# EAGLE design usb (EAGLE 9.5.0)
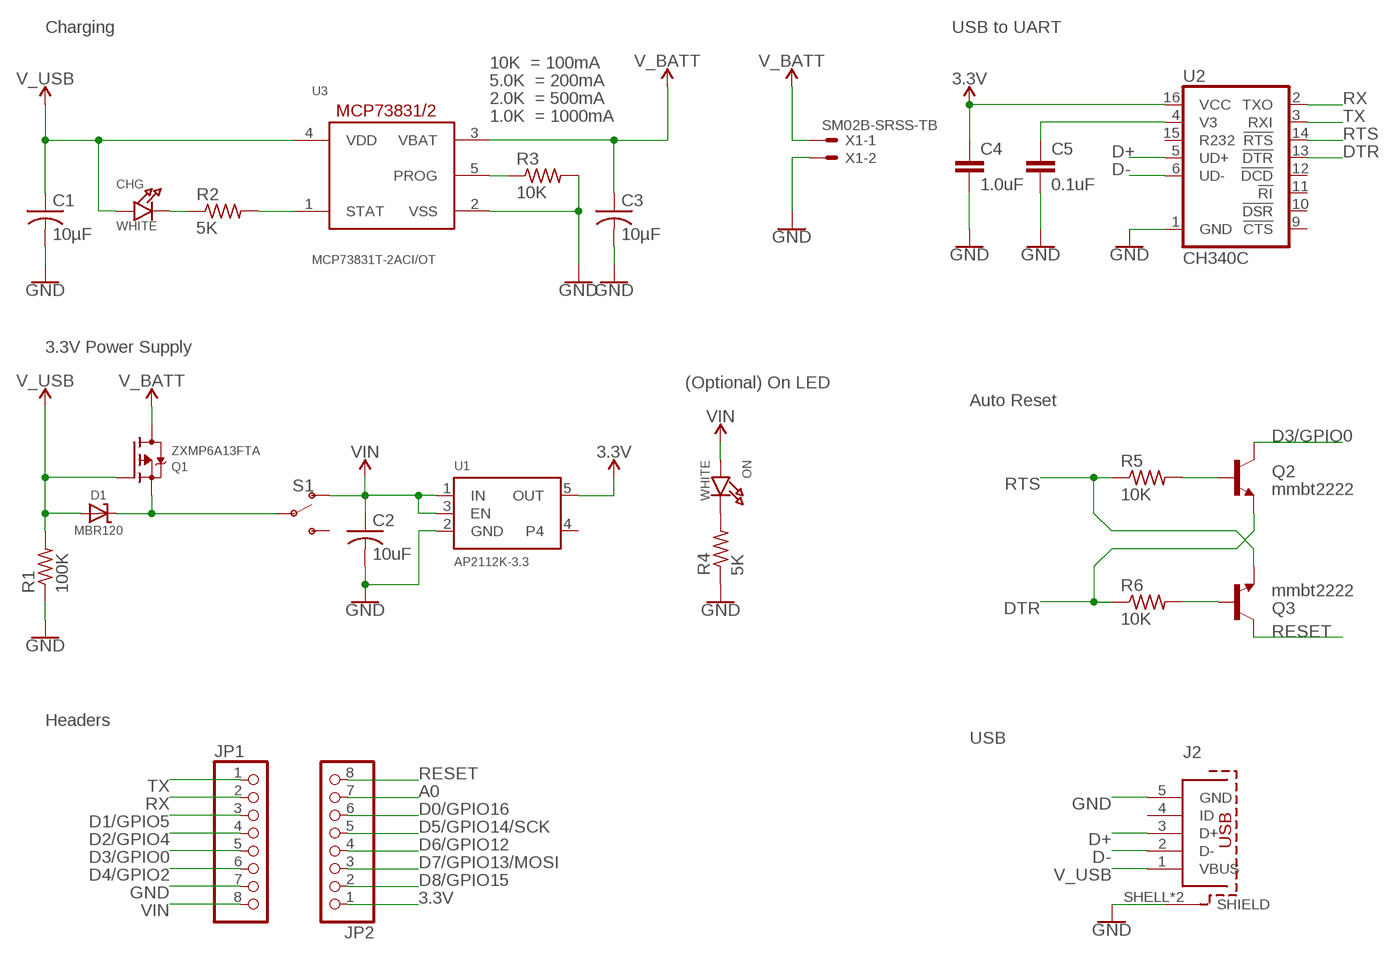
[diagram p0: schematic, sheet 1]

## Parts
C1  10µF  C-USC0805  [C0805]
C2  10uF  C-USC0805  [C0805]
C3  10µF  C-USC0805  [C0805]
C4  1.0uF  1.0UF-0805-25V-10%  [0805]
C5  0.1uF  1.0UF-0805-25V-10%  [0805]
CHG  WHITE  LED0805_NOOUTLINE  [CHIPLED_0805_NOOUTLINE]
D1  MBR120  DIODE-SCHOTTKYSOD-123  [SOD-123]
J2  614105150621  [614105150621]
JP1  PINHD-1X8CLEANBIG  [1X08-CLEANBIG]
JP2  PINHD-1X8CLEANBIG  [1X08-CLEANBIG]
ON  WHITE  LED0805_NOOUTLINE  [CHIPLED_0805_NOOUTLINE]
Q1  ZXMP6A13FTA  MOSFET-P  [SOT23-R]
Q2  mmbt2222  TRANSISTOR_NPNSOT23-3  [SOT23-3]
Q3  mmbt2222  TRANSISTOR_NPNSOT23-3  [SOT23-3]
R1  100K  R-US_R0805  [R0805]
R2  5K  R-US_R0805  [R0805]
R3  10K  R-US_R0805  [R0805]
R4  5K  R-US_R0805  [R0805]
R5  10K  R-US_R0603  [R0603]
R6  10K  R-US_R0603  [R0603]
S1  SWITCH-SPDT-SMD-AYZ0202  [SWITCH_DPDT_SMD_AYZ0202]
U1  AP2112K-3.3  VREG_SOT23-5  [SOT23-5]
U2  CH340C  [SO016]
U3  MCP73831T-2ACI/OT  MCP73831/OT  [SOT23-5L]
X1  SM02B-SRSS-TB  [SM02B-SRSS-TB]

## Nets
3.3V [power]: C4.1 JP2.1 U1.5(OUT) U2.16(VCC)
A0: JP2.7
D0/GPIO16: JP2.6
D1/GPIO5: JP1.3
D2/GPIO4: JP1.4
D3/GPIO0: JP1.5 Q2.3(C)
D4/GPIO2: JP1.6
D5/GPIO14/SCK: JP2.5
D6/GPIO12: JP2.4
D7/GPIO13/MOSI: JP2.3
D8/GPIO15: JP2.2
D+: J2.3(D+) U2.5(UD+)
D-: J2.2(D-) U2.6(UD-)
DTR: Q2.2(E) R6.1 U2.13(!DTR)
GND: C1.2 C2.2 C3.2 C4.2 C5.2 J2.5(GND) J2.SHELL1(SHIELD) J2.SHELL(SHIELD) JP1.7 R1.1 R3.2 R4.1 U1.2(GND) U2.1(GND) U3.2(VSS) X1.2
N$1: CHG.C R2.1
N$2: C5.1 U2.4(V3)
N$3: ON.C R4.2
N$4: R2.2 U3.1(STAT)
N$7 [power]: D1.C Q1.2(S) S1.5(P)
N$9: R3.1 U3.5(PROG)
N$13: Q3.1(B) R6.2
N$14: Q2.1(B) R5.2
RESET: JP2.8 Q3.3(C)
RTS: Q3.2(E) R5.1 U2.14(!RTS)
RX: JP1.2 U2.2(TXO)
TX: JP1.1 U2.3(RXI)
V_BATT [power]: C3.1 Q1.3(D) U3.3(VBAT) X1.1
V_USB [power]: C1.1 CHG.A D1.A J2.1(VBUS) Q1.1(G) R1.2 U3.4(VDD)
VIN [power]: C2.1 JP1.8 ON.A S1.6(O) U1.1(IN) U1.3(EN)
Unconnected: J2.4(ID) S1.4(S) U1.4 U2.9(!CTS) U2.10(!DSR) U2.11(!RI) U2.12(!DCD) U2.15(R232)

## Notes on the sheet
- Charging | USB to UART
- 10K  = 100mA
- 5.0K  = 200mA
- 2.0K  = 500mA
- 1.0K  = 1000mA
- 3.3V Power Supply
- (Optional) On LED
- Auto Reset
- Headers
- USB

## Library data of the parts
C1-C3 = adafruit:C-US: CAPACITOR, American symbol; MPN: CL21A106KPFNNNE
C4 = SparkFun-Capacitors:1.0UF: 1µF ceramic capacitors A capacitor is a passive two-terminal electrical component used to store electrical energy temporarily in an electric field.; MPN: C0805C105K4RAC7210; PROD_ID: CAP-08064
C5 = SparkFun-Capacitors:1.0UF: 1µF ceramic capacitors A capacitor is a passive two-terminal electrical component used to store electrical energy temporarily in an electric field.; MPN: C0805C104M3RACTU; PROD_ID: CAP-08064; VALUE: 1.0uF
CHG ON = microbuilder:LED: LED 0603 - 0603 Surface Mount Package 2mA: Green LED - Low Power (3.9mcd, 2ma, 1.7Vf) - Digikey: 475-2709-2-ND Orange LED - Low Power (9.8mcd, 2ma, 1.8Vf) - Digikey: 475-1194-2-ND Red LED - Low Power (5mcd, 2ma, 1.8Vf) - Digikey: 475-1195-2-ND Yellow LED - Low Power (7mcd, 2ma, 1.8Vf) - Digikey: 475-1196-2-ND 5mA: Blue LED - Low Power (17mcd, 5ma, 2.9Vf) - Digikey: LNJ937W8CRACT-ND 0805 - 0805 Surface Mount Package 2mA: Red LED (8.8mcd, 2mA, 1.8Vf, Clear) - Low Power [Digikey: 475-2510-1-ND] Green LED (5mcd, 2mA, 1.8Vf, Clear) - Low Power [Digikey: 475-2730-1-ND] Yellow LED (11.3mcd, 2mA, 1.8Vf, Clear) - Low Power [Digikey: 475-2555-1-ND] 20mA: Red LED (104mcd, 20mA, Diffused) - LS R976 [Digikey: 475-1278-6-ND] Red LED (12mcd, 20mA, 2.0Vf, Clear) - APT2012EC [Digikey: 754-1128-1-ND] Green LED (15mcd, 20mA, 2.2Vf, Clear) - APT2012GC [Digikey: 754-1131-1-ND] Orange LED (160mcd, 20mA, 2.1Vf, Clear) - APT2012SECK [Digikey: 754-1130-1-ND] 1206 - 1206 Surface Mount Package Green LED (26mcd, 20mA, Diffused) - LG N971 [Digikey: 475-1407-6-ND] Red LED (15mcd, 20mA, Diffused) - LH N974 [Digikey: 475-1416-6-ND] Cree - Cree High-Power Surface Mount LEDs XPEBWT-L1-0000-00D50 - White 111lm 350mA 2.9Vf 6200K 110° XTEAWT-00-0000-00000LEE3 - White 114lm 350mA 2.85Vf 5000K 115° Everlight - Everlight 45-21 Series Surface Mount LEDs 45-21/QK2C-B2832AC2CB2/2T - Warm White 2000mcd 20mA 3.25Vf 3050K 120° 45-21/LK2C-B38452C4CB2/2T - Nuetral White 2000mcd 20mA 3.25Vf 4150K 120° 45-21/LK2C-B50634C6CB2/2T - Cold White 2200mcd 20mA 3.25Vf 5650K 120° PLCC2 Reverse Mount LS T77K-J1L2-1-0-2-R18-Z - Red 11.25mcd 2mA 1.8Vf 630nm 120° LO T77K-L1M2-24-Z - Orange 19.6mcd 2mA 1.8Vf 606nm 120° LY T77K-K2M1-26-Z - Yellow 15.7mcd 2mA 1.8Vf 587nm 120°; MPN: NCD0805W2
D1 = microbuilder:DIODE-SCHOTTKY; MPN: MBR120ESFT1G
J2 = Wurth_Elektronik_Electromechanic_Input-Output_Connectors_rev19b_wider_slots:614105150621: WR-COM_USB_Micro Type AB_Vertical_THT; Micro Type AB Vertical THT - Tape & Reel not for Pick & Place machine Code : Con_I-O_COM_USB_2.0_AB_614105150621_614105150621 <http://katalog.we-online.de/media/images/eican/Con_I-O_COM_USB_2.0_AB_614105150621_pf2.jpg> Details see: http://katalog.we-online.de/em/datasheet/614105150621.pdf Created 12/08/2014, Dan Xu 2014 (C) Wurth Elektronik; BOTTOM: 1; MPN: U-D-M5DD-W-1; POPULATE: 1; THRU-HOLE: 1
JP1 JP2 = adafruit:PINHD-1X8: PIN HEADER; MPN: C27438; POPULATE: 1; THRU-HOLE: 1
Q1 = microbuilder:MOSFET-P: P-Channel Mosfet LEGEND VDS: Voltage Drain-Source ID: Drain Current RDS(ON): Drain-Source On-State Resistance VGS(TH): Gate-Source Threshold Voltage CISS: Drain-Source Input Capacitance SOT-23 Name VDS ID RDS(ON) VGS(TH) CISS Order Number IRLML5103 30V 760mA 600 mOhm -- 75pF @ 25V Digikey: IRLML5103PBFCT-ND IRLML6401 12V 4.3A 50 mOhm 950mV @ 250µA 830pF @ 10V Digikey: IRLML6401PBFTR-ND NTR0202PL 20V 400mA 800 mOhm 2.3V @ 250uA 70pF @ 5V Digikey: NTR0202PLT1GOSTR-ND NTR4101PT1G 20V 1.8A 85 mOhm 1.2V @ 250uA 675pF @ 10V Digikey: NTR4101PT1GOSCT-ND DMP2004K 20V 600mA 900 mOhm 1V @ 250uA 175pF @ 16V Digikey: DMP2004KDICT-ND PMV65XP 20V 3.9A 76 mOhm 950mV @ 1mA 725pF @ 20V Digikey: 568-2358-2-ND TO-252 Name VDS ID RDS(ON) VGS(TH) CISS Order Number AOD417 30V 25A 34 mOhm 3V @ 250µA 920pF @ 15V Digikey: 785-1106-2-ND PowerPak Name VDS ID RDS(ON) VGS(TH) CISS Order Number AON7401 30V 12A 14 mOhm 3V @ 250µA 2600pF @ 15V Digikey: 785-1302-1-ND; MPN: ZXMP6A13FTA
Q2 Q3 = SparkFun:TRANSISTOR_NPN: Transistor NPN BJT configuration in SOT23 package. MMBT2222 is the common NPN we use. Double check BCE configuration again layout.; MPN: MMBT2222A-G
R1 = adafruit:R-US_: RESISTOR, American symbol; MPN: 0805W8F1003T5E
R2 R4 = adafruit:R-US_: RESISTOR, American symbol; MPN: 0805W8F4871T5E
R3 = adafruit:R-US_: RESISTOR, American symbol; MPN: CRCW080510K0FKEAC
R5 R6 = adafruit:R-US_: RESISTOR, American symbol; MPN: RC0603FR-0710KL
S1 = SparkFun-Switches:SWITCH-SPDT: Single Pole, Double Throw (SPDT) Switch Single-pole, double-throw (SPDT) switch. Variant Overview SMD-AYZ0202 Surface Mount DPDT Switch <https://www.sparkfun.com/products/597> (COM-00597) Used on e.g. LilyPad Arduino USB - ATmega32U4 Board <https://www.sparkfun.com/products/12049> PTH-11.6X4.0MM SPDT Mini Power Switch <https://www.sparkfun.com/products/102> (COM-00102) Used on e.g. SparkFun Simon Says - Through-Hole Soldering Kit <https://www.sparkfun.com/products/10547> (KIT-10547) PTH-11.6X4.0MM-KIT KIT version of SPDT Mini Power Switch - Simplifies soldering by removing tStop of switch pins - only one side can be soldered. PTH-11.6X4.0MM-LOCK LOCK version of SPDT Mini Power Switch - Offset pins hold switch in place for easier soldering. SMD-RIGHT-ANGLE Surface Mount Right Angle Switch <https://www.sparkfun.com/products/10860> (COM-10860) Used on e.g. SparkFun ESP8266 Thing <https://www.sparkfun.com/products/13231>; MPN: AYZ0202AGRLC; PROD_ID: SWCH-08179; SF_ID: COM-00597
U1 = microbuilder:VREG_SOT23-5: SOT23-5 Fixed Voltage Regulators Part Current Out V Out V In V Dropout θJA (°C/W) TJ (°C) Digikey Part No. ADP121 150mA 3.3V 3.4-5.5V 0.09V @ 150mA -- -- ADP121-AUJZ33R7CT-ND ADP121 150mA 3.0V 3.1-5.5V 0.09V @ 150mA -- -- ADP121-AUJZ30R7CT-ND ADP122 300mA 3.3V 3.4-5.5V 0.085V @ 300mA -- -- ADP122AUJZ-3.3-R7CT-ND ADP1712 300mA 3.3V 3.5-5.5V 0.17V @ 300mA -- -- ADP1712AUJZ-3.3-R7TR-ND AP7311 (Low Cost) 150mA 3.3V 3.5-6V 0.15V @ 150mA -- -- AP7311-33WG-7DICT-ND LD39015M18R 150mA 1.8V 1.9V-5.5V 0.08V @ 100mA -- -- 497-6977-1-ND LP2985A-33DBVR 150mA 3.3V 3.3-16V 0.28V @ 150mA 206 150 296-18479-1-ND MCP1824T-3302E/OT 300mA 3.3V 3.5V-6V 0.2V @ 300mA -- -- MCP1824T-3302E/OTCT-ND MIC5205-2.5YM5 TR 150mA 2.5V 2.7-16V 0.165V @ 150mA -- -- 576-1257-2-ND MIC5205-3.0YM5 TR 150mA 3.0V 3.2V-16V 0.165V @ 150mA -- -- 576-1258-2-ND MIC5205-3.3YM5 TR 150mA 3.3V 3.5V-16V 0.165V @ 150mA -- -- 576-1259-2-ND TPS780330220 150mA 3.3V+2.2V 3.6-5.5V 250mV Max -- -- 296-23332-1-ND TDA3663/N1,135 100mA 3.3V 3.5-45V 0.18V @ 50mA -- -- 568-5343-1-ND Max operating temp can be calculated using θJA, TJ (max junction temperature), and power in watts. Set the "Maximum Ambient Temperature" until it reaches TJ ("Max Junction Temperature"), which is the absolute limit for safe use of the regulator: Heat Sink Temperature Calculator <http://www.daycounter.com/Calculators/Heat-Sink-Temperature-Calculator.phtml> For example, With 12V source into a 3.3V LP2985 and a 30mA load, we are dissipating (12V-3.3V) * 0.03A = 0.261W. With a θJA of 206 °C/W, a TJ of 150°C, and 261mW we can safely use the chip without a heat sink up to 75°C (=147.1°C Junction Temperature).; MPN: AP2112K-3.3
U2 = SparkFun-IC-Comms:CH340C; MPN: CH340C; PROD_ID: IC-14038
U3 = adafruit:MCP73831: MCP73831/2 Miniature Single-Cell, Fully Integrated Li-Ion, Li-Polymer Charge Management Controllers. Nice and small simple lipoly charge controller, with adjustable current and status output (LED) http://www.ladyada.net/library/pcb/eaglelibrary.html; MPN: MCP73831T-2ACI/OT
X1 = con-jst2.rpt:?M02B-SRSS-TB: Disconnectable Crimp style connector, 1.0mm pitch 2 contacts; MPN: SM02B-SRSS-TB

## Net classes
1 power: width 0.406 mm

## Board
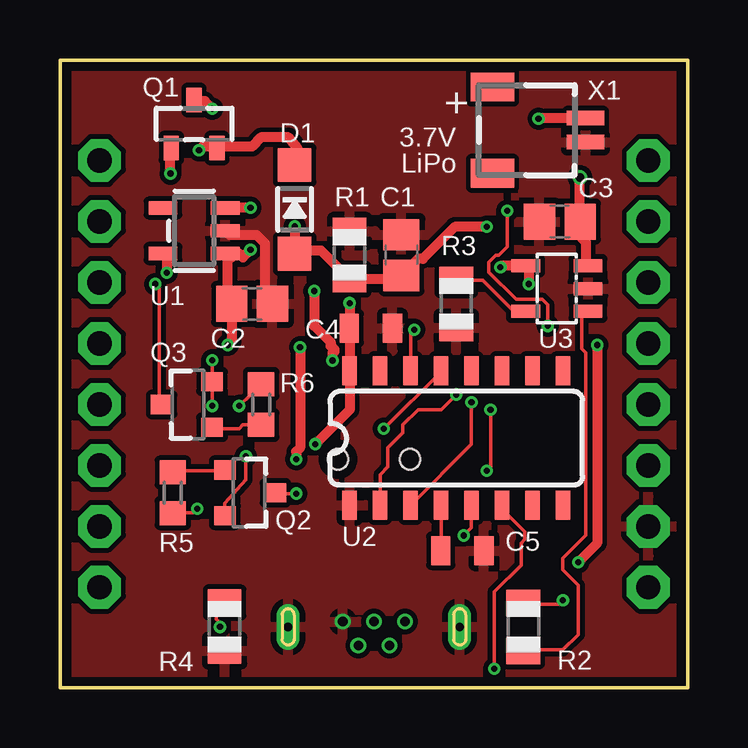
[diagram p1: board, top side]
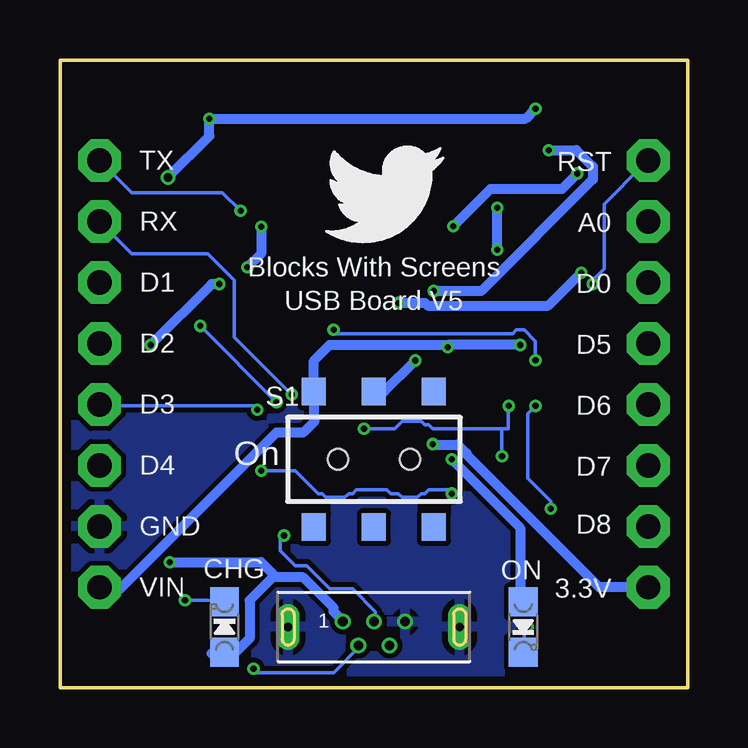
[diagram p2: board, bottom side, seen from below]

Size 26.16 x 26.16 mm. Coordinates in mm from the lower left corner, seen from the top.
Outline: 0,0 26.16,0 26.16,26.16 0,26.16 0,0
Copper layers (1*16): Top 0.035559375mm / dielectric 1.6mm / Bottom 0.035559375mm
Design rules "oshpark-2layer *": minimum track width 6mil, minimum drill 10mil, track to track 6mil, track to pad 6mil, pad to pad 6mil, via to via 6mil, smd to smd 6mil, copper to edge 15mil, drill to drill 6mil, minimum pad ring 5mil, minimum via ring 5mil, stop-mask expansion 2.5mil, vias tented up to drill 20mil, thermal gap 10mil
bRestrict: area 45,46.8 to 45.2,47.3; area 46,47.6 to 46.5,47.8

### Footprints (pad centres in the part's own frame; a part is rotated, then mirrored left to right if it is on the bottom)
C0805 = smd 1.3 x 1.5: 1 -0.85,0; 2 0.85,0
0805 = smd 0.8 x 1.2: 1 -0.9,0; 2 0.9,0
CHIPLED_0805_NOOUTLINE = smd 1.2 x 1.2: A 0,-1.05; C 0,1.05
SOD-123 = smd 1.4 x 1.4: A 1.85,0; C -1.85,0
614105150621 = drill 0.4: 1 -1.3,0.22; 2 -0.65,-0.78; 3 0,0.22; 4 0.65,-0.78; 5 1.3,0.22 | drill 0.35 pad 0.95 long: SHELL -3.575,0; SHELL1 3.575,0
1X08-CLEANBIG = drill 1.016 pad 1.778 octagon: 1 -8.89,0; 2 -6.35,0; 3 -3.81,0; 4 -1.27,0; 5 1.27,0; 6 3.81,0; 7 6.35,0; 8 8.89,0
SOT23-R = smd 0.635 x 1.016: 1 -0.95,-1; 2 0.95,-1; 3 0,1
SOT23-3 = smd 0.8 x 0.9: 1 -0.95,-1; 2 0.95,-1; 3 0,1.1
R0805 = smd 1.1 x 1.4: 1 -1,0; 2 1,0
R0603 = smd 1 x 1.1: 1 -0.85,0; 2 0.85,0
SWITCH_DPDT_SMD_AYZ0202 = smd 1 x 1.15: 1 -2.5,2.825; 2 0,2.825; 3 2.5,2.825; 4 -2.5,-2.825; 5 0,-2.825; 6 2.5,-2.825 | hole 0.85: 1.5,0; -1.5,0
SOT23-5 = smd 0.55 x 1.2: 1 -0.95,-1.3; 2 0,-1.3; 3 0.95,-1.3; 4 0.95,1.3; 5 -0.95,1.3
SO016 = smd 0.6 x 1.2: 1 -4.445,-2.8; 2 -3.175,-2.8; 3 -1.905,-2.8; 4 -0.635,-2.8; 5 0.635,-2.8; 6 1.905,-2.8; 7 3.175,-2.8; 8 4.445,-2.8; 9 4.445,2.8; 10 3.175,2.8; 11 1.905,2.8; 12 0.635,2.8; 13 -0.635,2.8; 14 -1.905,2.8; 15 -3.175,2.8; 16 -4.445,2.8
SOT23-5L = smd 0.55 x 1.2: 1 -0.95,-1.3; 2 0,-1.3; 3 0.95,-1.3; 4 0.95,1.3; 5 -0.95,1.3
SM02B-SRSS-TB = smd 0.6 x 1.55: 1 -0.5,2.975; 2 0.5,2.975 | smd 1.2 x 1.8: FIT@1 -1.8,-0.9; FIT@2 1.8,-0.9

### Placement (x,y rotation side)
C1  14.22,18.03 90 top
C2  8,16 0 top
C3  20.83,19.43 180 top
C4  12.95,14.99 0 top
C5  16.76,5.71 0 top
CHG  19.3,2.54 0 bottom
D1  9.78,19.94 270 top
J2  13.08,2.54 0 bottom
JP1  24.51,13.08 270 top
JP2  1.65,13.08 90 top
ON  6.86,2.54 180 bottom
Q1  5.59,23.5 0 top
Q2  7.87,8.13 270 top
Q3  5.33,11.81 90 top
R1  12.06,18.03 270 top
R2  19.3,2.54 270 top
R3  16.51,16 270 top
R4  6.86,2.56 90 top
R5  4.7,8.13 90 top
R6  8.38,11.81 270 top
S1  13.08,9.53 180 bottom
U1  5.59,19.05 90 top
U2  16.51,10.41 0 top
U3  20.7,16.64 90 top
U$1  [TWITTER5MM]  15.11,18.54 0 bottom
X1  18.92,23.24 270 top

### Tracks (layer width: path | path; a pad name or v marks a point on that pad's centre or on a via)
3.3V  (via drill 0.25)
  Top 0.406: U1.5 4.45,17.94 v4.45,17.3 | v12.06,16.03 12.06,15 C4.1 12.06,14.97 U2.16 12.06,11.59 v10.64,10.16
  Bottom 0.406: v12.06,16.03 10.95,16.03 10.84,15.93 5.82,15.93 v4.45,17.3 | v10.64,10.16 10.61,10.13 9.59,10.13 9.23,9.78 9.23,9.74 3.68,4.19 JP2.1
D3/GPIO0  (via drill 0.25)
  Top 0.152: v9.84,8.1 9.05,8.1 Q2.3 | v17.78,9.05 17.94,9.21 v17.94,11.59
  Bottom 0.152: v9.84,8.1 10,8.26 10.79,8.26 10.95,8.1 11.11,8.1 11.27,7.94 11.91,7.94 12.06,8.1 12.38,8.1 12.54,8.26 13.81,8.26 13.97,8.1 14.13,8.1 14.29,7.94 15.08,7.94 15.24,8.1 15.4,8.1 16.35,9.05 v17.78,9.05 | v17.94,11.59 18.1,11.75 24.45,11.75 JP1.5
D+  (via drill 0.25)
  Top 0.152: U2.5 17.14,6.67 v16.83,6.35
  Bottom 0.152: v16.83,6.35 16.99,6.19 16.99,5.71 16.35,5.08 15.88,5.08 14.92,4.13 13.97,4.13 13.02,3.17 13.02,3.02 12.86,2.86 12.86,2.7 13.02,2.7 J2.3
D-  (via drill 0.25)
  Top 0.152: v18.1,0.79 18.1,4 19.21,5.11 19.21,6.03 19.37,6.19 19.37,6.51 18.41,7.46 U2.6
  Bottom 0.152: v18.1,0.79 17.94,0.64 14.76,0.64 13.65,1.75 J2.2
DTR  (via drill 0.25)
  Top 0.152: v7.75,9.65 7.75,8.68 6.87,7.7 Q2.2 | v7.46,11.75 7.94,12.22 7.94,12.54 8.1,12.7 8.26,12.7 R6.1 | v13.49,10.79 15.88,13.18 U2.13
  Bottom 0.152: v7.46,11.75 7.49,11.72 7.49,10.79 7.75,10.79 | 7.75,10.79 v7.75,9.65 | v13.49,10.79 12.22,10.79 11.91,11.11 11.11,11.11 10.95,10.95 10.79,10.95 10.64,10.79 7.75,10.79
GND
  Top 0.406: U1.2 7.07,18.87 8.19,18.87 8.55,18.51 8.55,16.31 C2.2
  pour Bottom (isolate 0.203): 26.16,26.16 0,26.16 0,0 26.16,0
  pour Top (isolate 0.203): 26.16,26.16 0,26.16 0,0 26.16,0
N$1  (via drill 0.25)
  Top 0.152: v20.95,3.65 20.8,3.49 19.34,3.49 R2.1
  Bottom 0.152: v20.95,3.65 20,3.65 CHG.C
N$2
  Top 0.152: U2.4 15.88,5.71 C5.1
N$3  (via drill 0.25)
  Top 0.152: v6.67,2.54 6.67,2.7 6.51,2.86 6.51,3.49 6.83,3.49 R4.2
  Bottom 0.152: v6.67,2.54 6.83,2.38 6.83,1.59 ON.C
N$4
  Top 0.152: U3.1 21.91,15.72 21.75,15.72 21.75,14.13 21.91,13.97 21.91,6.35 20.95,5.4 20.95,4.92 21.59,4.29 21.59,2.22 20.95,1.59 19.34,1.59 R2.2
N$7  (via drill 0.25)
  Top 0.406: D1.C 9.9,22.48 9.53,22.94 8.38,22.94 8,22.55 6.55,22.55 Q1.2 6.33,22.48 6.25,22.55 5.94,22.55 v5.79,22.4 | v11.35,13.64 11.35,13.95 11.43,14.02 11.43,14.1 11.28,14.25 11.28,14.4 10.59,15.09 v10.59,16.54
  Bottom 0.406: v10.59,16.54 8.61,16.54 3.96,21.18 3.96,21.72 4.65,22.4 v5.79,22.4 | S1.5 12.64,12.35 v11.35,13.64
N$9
  Top 0.152: U3.5 19.37,15.72 18.89,15.72 17.62,16.99 16.51,16.99 R3.1
N$13
  Top 0.152: Q3.1 6.35,10.79 7.46,10.79 7.62,10.95 8.26,10.95 R6.2
N$14
  Top 0.152: Q2.1 6.83,9.05 4.76,9.05 R5.2
RESET  (via drill 0.25)
  Top 0.152: v3.97,16.83 4.13,16.67 4.13,11.91 Q3.3
  Bottom 0.152: v3.97,16.83 3.97,16.99 3.49,17.46 3.49,20.16 1.91,21.75 1.87,21.75 JP2.8
RTS  (via drill 0.25)
  Top 0.152: v6.35,11.75 6.35,12.7 Q3.2 6.35,12.86 v6.35,13.65 | v5.71,7.46 5.56,7.3 4.76,7.3 R5.1 | U2.14 14.61,14.76 v14.76,14.92
  Bottom 0.152: v6.35,11.75 6.67,11.43 6.67,8.73 5.71,7.78 v5.71,7.46 | v14.76,14.92 14.61,14.76 7.3,14.76 7.14,14.92 6.83,14.92 6.35,14.45 v6.35,13.65
RX  (via drill 0.25)
  Top 0.152: U2.2 13.34,8.89 13.65,9.21 13.65,10 14.29,10.64 14.29,10.95 14.92,11.59 15.88,11.59 v16.51,12.22
  Bottom 0.152: v16.51,12.22 18.89,14.61 18.89,16.99 20,18.1 23.18,18.1 JP1.2
TX  (via drill 0.25)
  Top 0.152: v17.14,11.91 17.14,10.16 U2.3 | v20.32,15.08 20.32,15.97 20.1,16.19 19,16.19 17.87,17.33 17.87,17.73 18.17,18.02 18.28,18.02 18.64,18.38 v18.64,19.88
  Bottom 0.152: v20.32,15.08 v17.14,11.91 | v18.64,19.88 19.4,20.64 23.18,20.64 JP1.1
V_BATT  (via drill 0.25, 0.35)
  Top 0.406: v6.35,24.13 6.03,24.45 5.71,24.45 Q1.3 | U3.3 21.91,17.62 21.91,18.57 21.75,18.73 21.75,18.89 21.66,18.98 21.66,19.36 | 21.66,19.36 C3.1 | X1.1 19.96,23.74 v19.94,23.72 | 21.66,19.36 v21.66,21.27
  Bottom 0.406: v6.35,24.13 6.76,23.72 v19.94,23.72 19.94,23 v21.66,21.27
V_USB  (via drill 0.25)
  Top 0.406: v18.35,17.53 18.35,17.59 U3.4 19.53,17.46 v19.53,16.83 | v4.6,21.43 4.6,22.38 Q1.1 | v21.59,5.24 22.38,6.03 v22.38,14.29 | v17.78,19.21 16.45,19.21 15.12,17.88 14.92,17.88 C1.1 14.07,17.03 R1.2 10.88,18.22 9.91,18.22 | v9.78,19.24 9.78,18.22 9.91,18.22 | 9.91,18.22 D1.A
  Bottom 0.406: 17.3,4.6 18.26,3.65 18.26,2.06 18.89,1.43 19.84,1.43 CHG.A | 17.3,4.6 16.03,4.6 14.76,3.33 14.76,3.17 14.45,2.86 J2.1 | v17.78,19.21 17.78,18.1 v18.35,17.53 | v4.6,21.43 5.24,20.8 8.22,20.8 v9.78,19.24 | v21.59,5.24 17.78,5.24 17.3,4.76 17.3,4.6 | v22.38,14.29 19.84,16.83 v19.53,16.83
VIN  (via drill 0.25)
  Top 0.406: v9.84,9.53 9.84,9.84 10,10 v10,14.19 | v7.94,20 6.99,20 U1.3 | v7.94,18.26 7.62,17.94 7.46,18.1 7.14,18.1 7.14,17.94 U1.1 6.99,17.94 6.99,16.17 C2.1 7.15,14.45 v6.99,14.29
  Bottom 0.406: v6.99,14.29 10,14.29 | 10,14.29 14.92,14.29 15.58,13.63 S1.6 15.58,11.14 15.56,11.11 16.03,10.64 17.14,10.64 23.65,4.13 24.45,4.13 JP1.8 | v9.84,9.53 6.99,6.67 6.99,3.65 ON.A | 10,14.29 v10,14.19 | v7.94,18.26 v7.94,20

### Text on the board
tNames: + | 3.7V / LiPo
bNames: RST | TX | A0 | RX | D0 | Blocks With Screens | D1 | USB Board V5 | D5 | D2 | D6 | D3 | D7 | On | D4 | D8 | GND | 3.3V | VIN